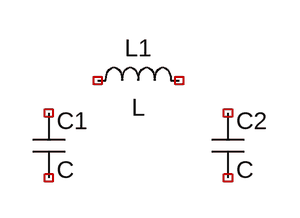
[diagram p0: schematic Simulacion.asc]
Simulacion.asc, the LTspice schematic file:
Version 4
SHEET 1 880 680
SYMBOL ind 176 144 R270
WINDOW 0 32 56 VTop 2
WINDOW 3 5 56 VBottom 2
SYMATTR InstName L1
SYMBOL cap 128 160 R0
SYMATTR InstName C1
SYMBOL cap 304 160 R0
SYMATTR InstName C2

The netlist it stands for:
* Simulacion.asc
L1 NC_01 NC_02 L
C1 NC_03 NC_04 C
C2 NC_05 NC_06 C
.backanno
.end